# Altium project doergreie.PrjPcb
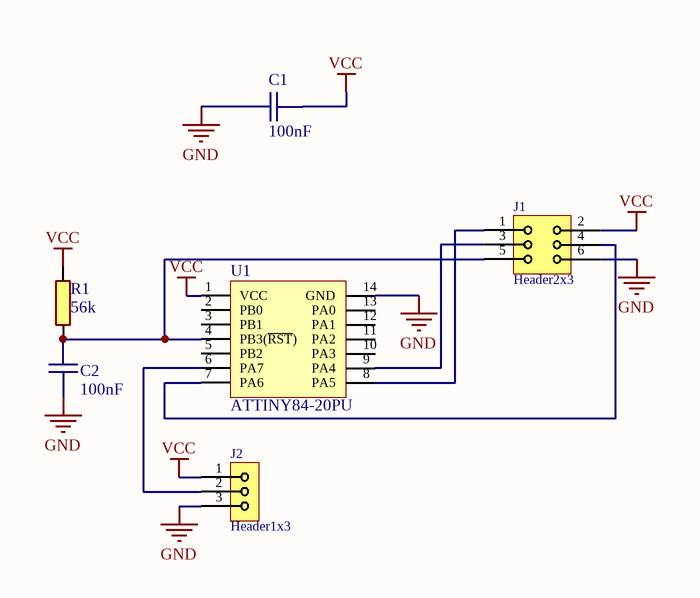
[diagram p0: doergreie.SchDoc]
1 sheet, 6 parts. Net scope: global (net labels, ports and power ports of the same name join across sheets).
Board file: doergreie.PcbDoc

## Sheet doergreie.SchDoc
size A4

### Parts
C1  100nF  [CAPAR500W50L730T250H650]
C2  100nF  [CAPAR500W50L730T250H650]
J1  Header2x3  [HDRV6W64P254_2X3_762X508X900B]
J2  Header1x3  [HDRV3W64P254_1X3_762X254X900B]
R1  56k  [RESA_0.25W]
U1  ATTINY84-20PU  [DIP14]

### Nets
GND: C1.1 C2.1 J1.6 J2.3 U1.14(GND)
VCC: C1.2 J1.2 J2.1 R1.2 U1.1(VCC)
NetC2_2: C2.2 J1.5 R1.1 U1.4(PB3(~{RST}))
NetJ1_1: J1.1 U1.8(PA5)
NetJ1_3: J1.3 U1.9(PA4)
NetJ1_4: J1.4 U1.7(PA6)
NetJ2_2: J2.2 U1.6(PA7)

Not connected (* = marked no-connect by the designer): U1 2(PB0) 3(PB1) 5(PB2) 10(PA3) 11(PA2) 12(PA1) 13(PA0)

### Library data of the parts
C1 C2 = 3269: 100V plast; id: 3269; rad: 7; rom: OV; lager_type: Fremlager; dybde: 0; hylle: 3; antall: 400; kolonne: 1; pakke_opprettet_av: 1335; pakke_opprettet: 16.11.2016 21.11.30; symbol_opprettet_av: 815; symbol_opprettet: 14.11.2014 20.19.34; leverandor_varenr: 2525325; pris: 2; leverandor: Farnell; pakketype: TH; navn: 100nF
J1 = 3187: id: 3187; pakke_opprettet_av: 815; pakke_opprettet: 23.07.2015 20.17.54; symbol_opprettet: 13.11.2014 11.03.43; beskrivelse: 2,54mm pitch; pris: 3; pakketype: TH; symbol_opprettet_av: 815; navn: Header 2x3
J2 = 2430: id: 2430; pakke_opprettet_av: 815; pakke_opprettet: 13.11.2014 12.31.03; symbol_opprettet: 13.11.2014 10.59.05; beskrivelse: 2,54mm pitch; pris: 2; pakketype: TH; symbol_opprettet_av: 815; navn: Header 1x3
R1 = 2849: 0.25W 1% Generic resistor; id: 2849; rad: 8; rom: OV; lager_type: Fremlager; dybde: 2; antall: 100; kolonne: 1; pakke_opprettet_av: 815; pakke_opprettet: 28.06.2014 17.13.33; symbol_opprettet: 08.07.2014 21.16.33; pris: 0; nokkelord: Motstand, Resistor; pakketype: TH; hylle: 8; symbol_opprettet_av: 815; navn: 56k
U1 = 2154: id: 2154; rad: 3; rom: OV; lager_type: Fremlager; dybde: 2; hylle: 0; antall: 50; kolonne: 1; pakke_opprettet_av: 1335; pakke_opprettet: 22.03.2017 20.38.51; symbol_opprettet_av: 815; symbol_opprettet: 08.04.2017 19.59.27; beskrivelse: Mikrokontroller; produsent: Atmel; pakketype: DIP; navn: ATTINY84-20PU; pris: 0